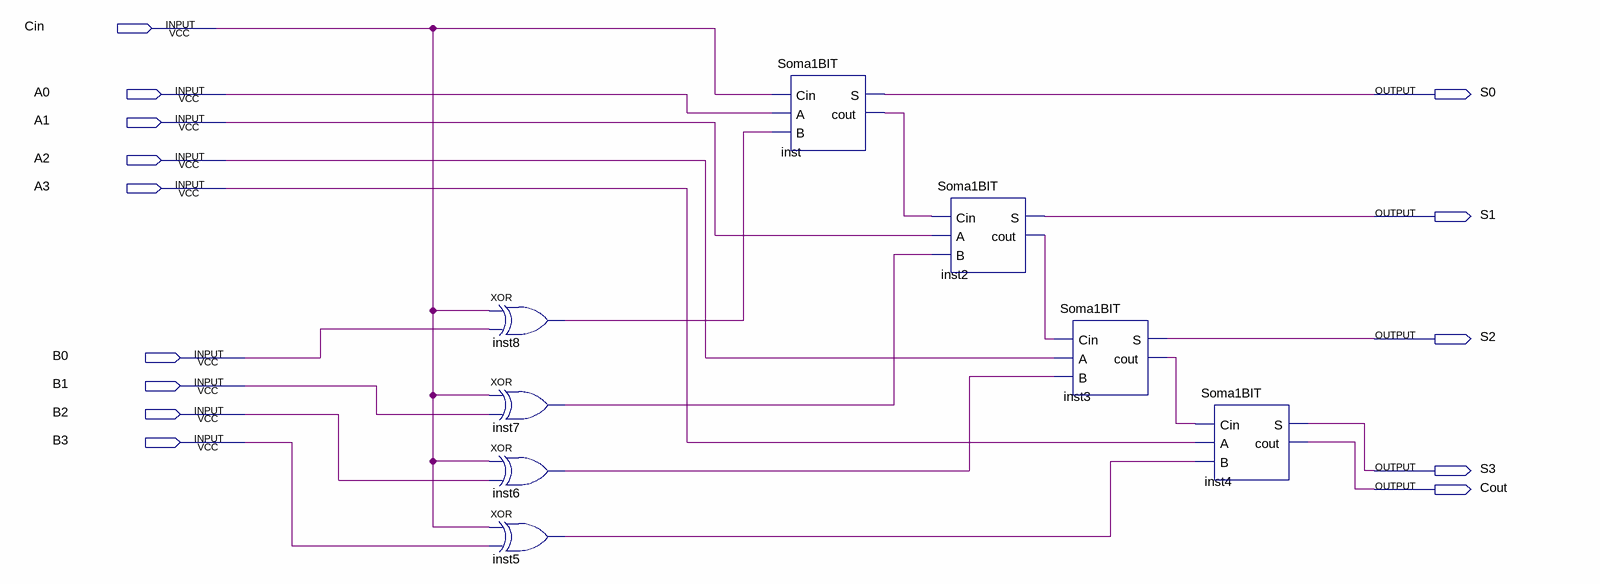
[diagram p0: schematic sheet]
// Quartus schematic SOMA4BIT.bdf as structural Verilog: 8 symbols, 14 pins
module SOMA4BIT (
  input  Cin,
  input  A0,
  input  A1,
  input  A2,
  input  A3,
  input  B0,
  input  B1,
  input  B2,
  input  B3,
  output S0,
  output S1,
  output S2,
  output S3,
  output Cout
);

  wire inst2_cout, inst3_cout, inst5_out, inst6_out, inst7_out, inst8_out, inst_cout;

  xor inst8 (inst8_out, Cin, B0);
  xor inst7 (inst7_out, Cin, B1);
  xor inst6 (inst6_out, Cin, B2);
  xor inst5 (inst5_out, Cin, B3);
  Soma1BIT inst (.Cin(Cin), .A(A0), .B(inst8_out), .S(S0), .cout(inst_cout));
  Soma1BIT inst2 (.Cin(inst_cout), .A(A1), .B(inst7_out), .S(S1), .cout(inst2_cout));
  Soma1BIT inst3 (.Cin(inst2_cout), .A(A2), .B(inst6_out), .S(S2), .cout(inst3_cout));
  Soma1BIT inst4 (.Cin(inst3_cout), .A(A3), .B(inst5_out), .S(S3), .cout(Cout));
endmodule
